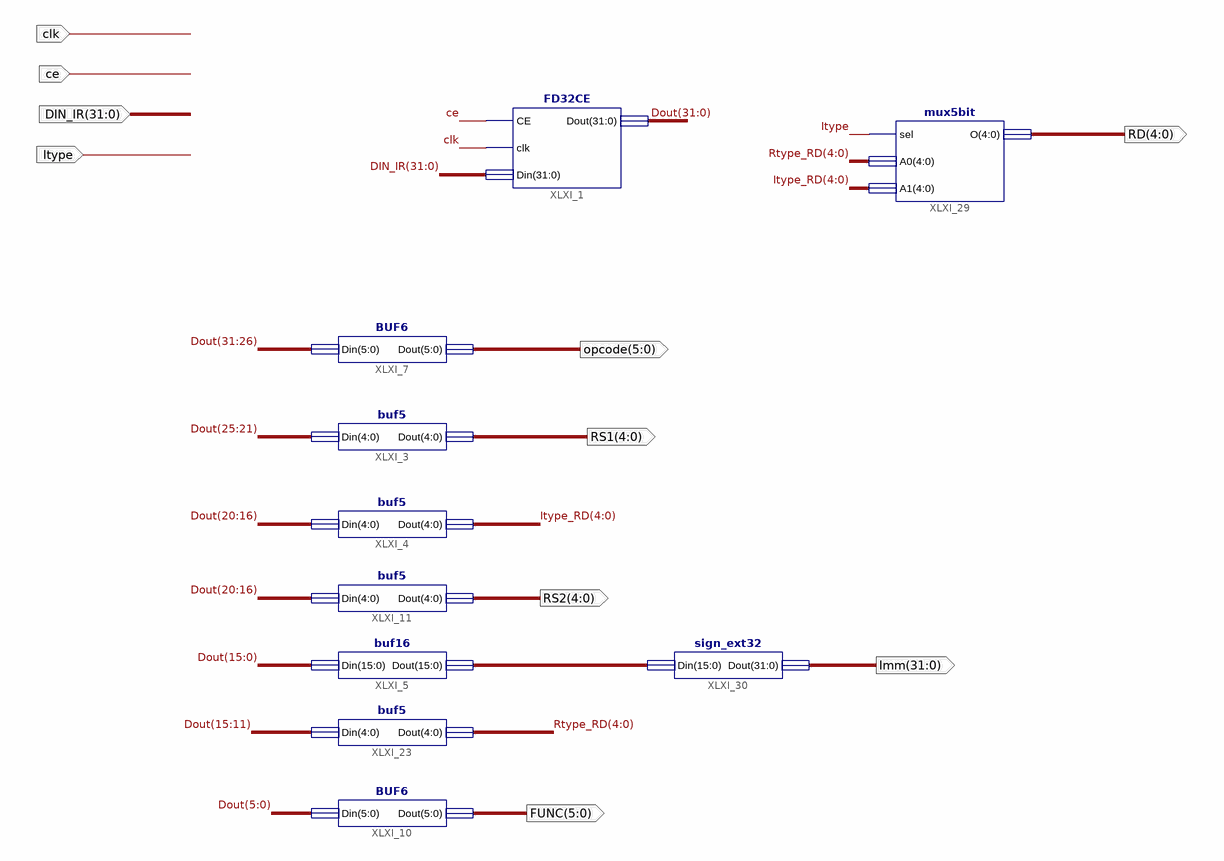
[diagram p0: schematic sheet 1]
// Xilinx ISE schematic myIR.sch (spartan2) as structural Verilog: 10 symbols, 10 ports
module myIR (
  input  clk,
  input  ce,
  input  [31:0] DIN_IR,
  input  Itype,
  output [4:0] RS1,
  output [5:0] opcode,
  output [5:0] FUNC,
  output [4:0] RS2,
  output [4:0] RD,
  output [31:0] Imm
);

  wire [4:0] Itype_RD, Rtype_RD;
  wire [15:0] XLXN_53;
  wire [31:0] Dout;

  FD32CE XLXI_1 (.CE(ce), .clk(clk), .Din(DIN_IR), .Dout(Dout));
  buf5 XLXI_4 (.Din(Dout[20:16]), .Dout(Itype_RD));
  buf5 XLXI_11 (.Din(Dout[20:16]), .Dout(RS2));
  buf5 XLXI_3 (.Din(Dout[25:21]), .Dout(RS1));
  BUF6 XLXI_7 (.Din(Dout[31:26]), .Dout(opcode));
  buf16 XLXI_5 (.Din(Dout[15:0]), .Dout(XLXN_53));
  buf5 XLXI_23 (.Din(Dout[15:11]), .Dout(Rtype_RD));
  BUF6 XLXI_10 (.Din(Dout[5:0]), .Dout(FUNC));
  mux5bit XLXI_29 (.sel(Itype), .A0(Rtype_RD), .A1(Itype_RD), .O(RD));
  sign_ext32 XLXI_30 (.Din(XLXN_53), .Dout(Imm));
endmodule
